# Altium project Performance_Fitness_Vest.PrjPcb (part 2 of 2)

## Sheet PTFV_GECKO_PWR.SchDoc: PTFV_GECKO_PWR_&_RF
size A4; DrawnBy: Aneesh & Vaishnavi; Revision: 1; SheetNumber: 3; SheetTotal: 3  of  5
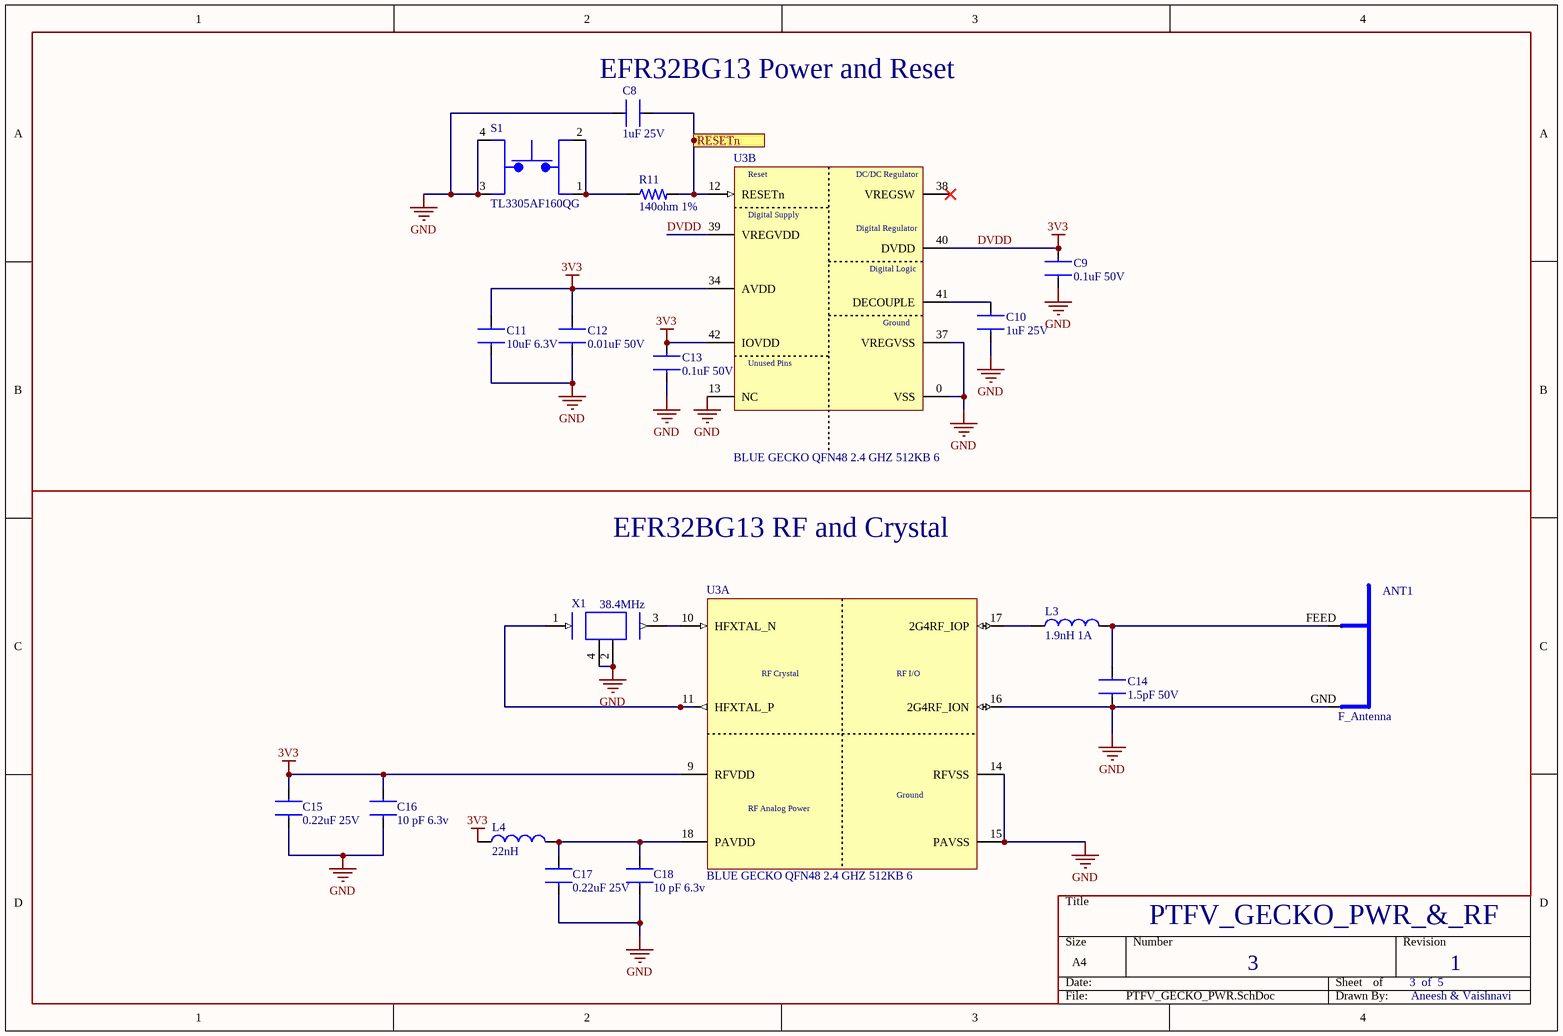
[diagram p2: PTFV_GECKO_PWR.SchDoc]

### Parts
ANT1  F_Antenna
C8  1uF 25V  [CAP_0603_1MM]
C9  0.1uF 50V  [CAP_0603_1MM]
C10  1uF 25V  [CAP_0603_1MM]
C11  10uF 6.3V  [CAP_0603_1MM]
C12  0.01uF 50V  [CAP_0603_1MM]
C13  0.1uF 50V  [CAP_0603_1MM]
C14  1.5pF 50V  [CAP_0402_1mm]
C15  0.22uF 25V  [CAP_0603_1MM]
C16  10 pF 6.3v  [CAP_0603_1MM]
C17  0.22uF 25V  [CAP_0603_1MM]
C18  10 pF 6.3v  [CAP_0603_1MM]
L3  1.9nH 1A  [CAP_0402_1mm]
L4  22nH  [IND_1608X10N]
R11  140ohm 1%  [RES_0603_1608X06]
S1  TL3305AF160QG  [SW_TL3305AF160QG]
U3  BLUE GECKO QFN48 2.4 GHZ 512KB 6  [QFN_48_7X7]  (parts A,B of 3)
X1  38.4MHz  [OSC_38.4MHz]

### Blocks framed on the sheet
EFR32BG13 Power and Reset: C8-C13 R11 S1 U3
EFR32BG13 RF and Crystal: ANT1 C14-C18 L3 L4 U3 X1

### Ports
RESETn (in, see PTFV_MECHANICAL[3A])

### Nets
3V3: C9.1 C11.1 C12.1 C13.1 C15.1 C16.1 L4.1 U3.9(RFVDD) U3.34(AVDD) U3.39(VREGVDD) U3.40(DVDD) U3.42(IOVDD)  [also labelled DVDD]
GND: ANT1.GND C8.2 C9.2 C10.2 C11.2 C12.2 C13.2 C14.2 C15.2 C16.2 C17.2 C18.2 S1.3 S1.4 U3.0(VSS) U3.13(NC) U3.14(RFVSS) U3.15(PAVSS) U3.16(2G4RF_ION) U3.37(VREGVSS) X1.2 X1.4
NetANT1_FEED: ANT1.FEED C14.1 L3.2
NetC8_1: C8.1 R11.2 U3.12(RESETn) ; port RESETn
NetC10_1: C10.1 U3.41(DECOUPLE)
NetC17_1: C17.1 C18.1 L4.2 U3.18(PAVDD)
NetL3_1: L3.1 U3.17(2G4RF_IOP)
NetR11_1: R11.1 S1.1 S1.2
NetU3_10: U3.10(HFXTAL_N) X1.3
NetU3_11: U3.11(HFXTAL_P) X1.1

Not connected (* = marked no-connect by the designer): U3 38(VREGSW)*

### Notes on the sheet
- (in symbol EFR32BG13P632F512GM48-DR, part A) RF Crystal; RF I/O; Ground; RF Analog Power
- (in symbol EFR32BG13P632F512GM48-DR, part B) Reset; DC/DC Regulator; Digital Supply; Digital Regulator; Digital Logic; Ground; Unused Pins

### Library data of the parts
ANT1 = F_Antenna: Inverted F Antenna
C8 C10 = CC0603KRX5R8BB105: CAP CER 1uF 25V X5R 0603; Manufacturer: Yageo; Dielectric Material: Ceramic; Multilayer: Yes; Tolerance  (fill in as +-): 10%; Supplier: Digi-Key; Supplier Part Number: 311-1445-1-ND; Manufacturer Part Number: CC0603KRX5R8BB105; RoHS: Yes; Category: Ceramic Capacitors; Stock: 2764440; Pricing: 1=0.1, 10=0.074, 50=0.0418, 100=0.0346, 500=0.02428, 1000=0.0201 (USD); Mounting Technology: Surface Mount; Pins: 2; Package Shape: Rectangular; Case/Package: 0603; Terminal Finish: Nickel; Min Operating Temperature: -55°C; Max Operating Temperature: 85°C; JESD-609 Code: e3; Value: 1uF; Capacitor Type: Ceramic; Package Style: SMTMeter; Packaging: Tape and Reel; Tolerance (fill in as +-): 10%; Rated DC Voltage (URdc): 25V; Temperature Characteristics Code: X5R; Termination: Wraparound; Length: 1.6mm; Width: 0.8mm; Height: 0.8mm; Reach SVHC Compliant: Yes; RoHS Compliant: Yes; ComponentLink1URL: https://datasheet.ciiva.com:443/pdfs/VipMasterIC/IC/YAGO/YAGO-S-A0006851646/YAGO-S-A0006851646-1.pdf?src-supplier=IHS+Markit; ComponentLink1Description: https://datasheet.ciiva.com:443/pdfs/VipMasterIC/IC/YAGO/YAGO-S-A0006851646/YAGO-S-A0006851646-1.pdf?src-supplier=IHS+Markit; ComponentLink2URL: https://datasheet.ciiva.com/7978/1525783-7978171.pdf?src-supplier=Element14; ComponentLink2Description: https://datasheet.ciiva.com/7978/1525783-7978171.pdf?src-supplier=Element14; ComponentLink3URL: https://datasheet.ciiva.com/11586/upy-gphc-x5r-4v-to-50v-12-11586318.pdf?src-supplier=Avnet; ComponentLink3Description: https://datasheet.ciiva.com/11586/upy-gphc-x5r-4v-to-50v-12-11586318.pdf?src-supplier=Avnet; ComponentLink4URL: https://datasheet.ciiva.com/176/mlccorderingcode-176786.pdf?src-supplier=Digi-Key; ComponentLink4Description: https://datasheet.ciiva.com/176/mlccorderingcode-176786.pdf?src-supplier=Digi-Key; ComponentLink5URL: https://datasheet.ciiva.com/176/mlccorderingcode-176785.pdf?src-supplier=Digi-Key; ComponentLink5Description: https://datasheet.ciiva.com/176/mlccorderingcode-176785.pdf?src-supplier=Digi-Key; ComponentLink6URL: https://datasheet.ciiva.com/176/mlccorderingcode-176787.pdf?src-supplier=Digi-Key; ComponentLink6Description: https://datasheet.ciiva.com/176/mlccorderingcode-176787.pdf?src-supplier=Digi-Key
C9 C13 = CC0603KRX5R9BB104: CAP CER 0.1UF 50V X5R 0603; Manufacturer: Yageo; Value: 100nF; Tolerance: 10%; Supplier: Digi-Key; Supplier Part Number: 311-4046-1-ND; Manufacturer Part Number: CC0603KRX5R9BB104; RoHS: Yes; Category: Ceramic Capacitors; Stock: 45165; Pricing: 1=0.1, 10=0.052, 50=0.0282, 100=0.0231, 500=0.01648, 1000=0.01294 (USD); Mounting Technology: Surface Mount; Case/Package: 0603; Case Code (Imperial): 0603; Case Code (Metric): 1608; Weight: 7.1E-05oz; Min Operating Temperature: -55°C; Max Operating Temperature: 85°C; Packaging: Tape and Reel; Voltage Rating: 50V; Dielectric: X5R; Termination: SMD/SMT; Voltage Rating (DC): 50V; Package Quantity: 4000; Series: CC; Length: 0.063inch; Width: 0.031inch; Thickness: 0.035inch; Lead Free: Lead Free; Halogen Free: Halogen Free; ComponentLink1URL: http://www.mouser.com/ds/2/447/Yageo_UPY-GP_NP0_16V-to-50V_9-358835.pdf?src-supplier=Mouser; ComponentLink1Description: http://www.mouser.com/ds/2/447/Yageo_UPY-GP_NP0_16V-to-50V_9-358835.pdf?src-supplier=Mouser; ComponentLink2URL: http://www.yageo.com/exep/pages/download/literatures/ProductSelectionGuide%202014_Final_2.pdf?src-supplier=Digi-Key; ComponentLink2Description: http://www.yageo.com/exep/pages/download/literatures/ProductSelectionGuide%202014_Final_2.pdf?src-supplier=Digi-Key; ComponentLink3URL: https://datasheet.octopart.com/CC0603KRX5R9BB104-Yageo-datasheet-158238148.pdf?src-supplier=Newark; ComponentLink3Description: https://datasheet.octopart.com/CC0603KRX5R9BB104-Yageo-datasheet-158238148.pdf?src-supplier=Newark; ComponentLink4URL: https://www.yageo.com/upload/media/product/productsearch/datasheet/mlcc/UPY-GPHC_X5R_4V-to-50V_26.pdf?src-supplier=Digi-Key; ComponentLink4Description: https://www.yageo.com/upload/media/product/productsearch/datasheet/mlcc/UPY-GPHC_X5R_4V-to-50V_26.pdf?src-supplier=Digi-Key; ComponentLink5URL: https://datasheet.octopart.com/CC0603KRX5R9BB104-Yageo-datasheet-137875056.pdf?src-supplier=Future+Electronics; ComponentLink5Description: https://datasheet.octopart.com/CC0603KRX5R9BB104-Yageo-datasheet-137875056.pdf?src-supplier=Future+Electronics
C11 = CL10A106MQ8NNNC: CAP CER 10UF 6.3V X5R 0603; Manufacturer: Samsung; Tolerance: 20%; Supplier: Digi-Key; Supplier Part Number: 1276-1119-1-ND; Manufacturer Part Number: CL10A106MQ8NNNC; RoHS: Yes; Category: Ceramic Capacitors; Stock: 2041935; Pricing: 1=0.11, 10=0.083, 50=0.0452, 100=0.0369, 500=0.02638, 1000=0.02072 (USD); Mounting Technology: Surface Mount; Case/Package: 0603; Case Code (Metric): 1608; Case Code (Imperial): 0603; Min Operating Temperature: -55°C; Max Operating Temperature: 85°C; Packaging: Tape and Reel; Value: 10uF; Voltage Rating: 6.3V; Dielectric: X5R; Voltage: 6.3V; Series: CL; Construction: Flat; Length: 1.6mm; Height: 0.8mm; Depth: 0.8mm; Radiation Hardening: No; RoHS Compliant: Yes; ComponentLink1URL: https://datasheet.ciiva.com/25798/cl10a106mq8nnnc-25798320.pdf?src-supplier=Digi-Key; ComponentLink1Description: https://datasheet.ciiva.com/25798/cl10a106mq8nnnc-25798320.pdf?src-supplier=Digi-Key; ComponentLink2URL: https://datasheet.ciiva.com/26838/getdatasheetpartid-357557-26838347.pdf?src-supplier=Verical; ComponentLink2Description: https://datasheet.ciiva.com/26838/getdatasheetpartid-357557-26838347.pdf?src-supplier=Verical; ComponentLink3URL: https://datasheet.ciiva.com/16437/cl05b104kq5nnnc-16437327.pdf?src-supplier=Future+Electronics; ComponentLink3Description: https://datasheet.ciiva.com/16437/cl05b104kq5nnnc-16437327.pdf?src-supplier=Future+Electronics
C12 = CC0603KRX7R9BB103: CAP CER 0.01uF 50V X7R 0603; Manufacturer: Yageo; Dielectric Material: Ceramic; Value: 10nF; Multilayer: Yes; Tolerance  (fill in as +-): 10%; Supplier: Digi-Key; Supplier Part Number: 311-1085-1-ND; Manufacturer Part Number: CC0603KRX7R9BB103; RoHS: Yes; Category: Ceramic Capacitors; Stock: 5912727; Pricing: 1=0.1, 10=0.032, 50=0.0176, 100=0.0144, 500=0.01026, 1000=0.00805 (USD); Mounting Technology: Surface Mount; Pins: 2; Package Shape: Rectangular; Case/Package: 0603; Terminal Finish: Nickel; Min Operating Temperature: -55°C; Max Operating Temperature: 125°C; JESD-609 Code: e3; Capacitor Type: Ceramic; Package Style: SMTMeter; Packaging: Tape and Reel; Tolerance (fill in as +-): 10%; Rated DC Voltage (URdc): 50V; Temperature Characteristics Code: X7R; Termination: Wraparound; Length: 1.6mm; Width: 0.8mm; Height: 0.8mm; Reach SVHC Compliant: Yes; RoHS Compliant: Yes; ComponentLink1URL: https://datasheet.ciiva.com:443/pdfs/VipMasterIC/IC/YAGO/YAGO-S-A0003557223/YAGO-S-A0003557223-1.pdf?src-supplier=IHS+Markit; ComponentLink1Description: https://datasheet.ciiva.com:443/pdfs/VipMasterIC/IC/YAGO/YAGO-S-A0003557223/YAGO-S-A0003557223-1.pdf?src-supplier=IHS+Markit; ComponentLink2URL: https://datasheet.ciiva.com/28450/1489800-28450619.pdf?src-supplier=Element14; ComponentLink2Description: https://datasheet.ciiva.com/28450/1489800-28450619.pdf?src-supplier=Element14; ComponentLink3URL: https://datasheet.ciiva.com/176/mlccorderingcode-176551.pdf?src-supplier=Digi-Key; ComponentLink3Description: https://datasheet.ciiva.com/176/mlccorderingcode-176551.pdf?src-supplier=Digi-Key; ComponentLink4URL: https://datasheet.ciiva.com/176/mlccorderingcode-176550.pdf?src-supplier=Digi-Key; ComponentLink4Description: https://datasheet.ciiva.com/176/mlccorderingcode-176550.pdf?src-supplier=Digi-Key; ComponentLink5URL: https://datasheet.ciiva.com/13389/upy-gphc-x7r-6-3v-to-50v-8-13389991.pdf?src-supplier=Mouser; ComponentLink5Description: https://datasheet.ciiva.com/13389/upy-gphc-x7r-6-3v-to-50v-8-13389991.pdf?src-supplier=Mouser
C14 = GCM1555C1H1R5JA16D: CAP CER 1.5pF 50V C0G 5% Pad SMD 0402 125C Automotive T/R; Manufacturer: Murata; Supplier 1: Digi-Key; Manufacturer Part Number: GCM1555C1H1R5JA16D; RoHS: Yes; Category: Ceramic Capacitors; Stock 1: 77943; Pricing 1: 1=0.10000, 10=0.04700, 50=0.02580, 100=0.02100, 500=0.01502, 1000=0.01180, 2500=0.01072, 5000=0.00987 (USD); Mount: Surface Mount; Case/Package: 0402; Case Code (Imperial): 0402; Case Code (Metric): 1005; Min Operating Temperature: -55°C; Max Operating Temperature: 125°C; Packaging: Cut Tape; Capacitance: 1.5pF; Tolerance: 5%; Voltage Rating: 50V; Ratings: AEC-Q200; ComponentLink1URL: http://search.murata.co.jp/Ceramy/image/img/A01X/G101/ENG/GCM1555C1H1R5JA16-01.pdf?src-supplier=Digi-Key; ComponentLink1Description: http://search.murata.co.jp/Ceramy/image/img/A01X/G101/ENG/GCM1555C1H1R5JA16-01.pdf?src-supplier=Digi-Key
C15 C17 = VJ0603Y224KXXCW1BC: CAP CER 0.22UF 25V X7R 0603; Manufacturer: Vishay Vitramon; Dielectric Material: Tantalum; Value: 220nF; Tolerance: 10%; Supplier: Digi-Key; Supplier Part Number: 720-VJ0603Y224KXXCW1BCCT-ND; Manufacturer Part Number: VJ0603Y224KXXCW1BC; RoHS: Yes; Category: Ceramic Capacitors; Stock: 7772; Pricing: 1=0.17, 10=0.116, 50=0.0696, 100=0.0587, 500=0.04018, 1000=0.03554 (USD); Mounting Technology: Surface Mount; Case/Package: 0603; Min Operating Temperature: -55°C; Max Operating Temperature: 125°C; Dielectric: X7R; Voltage Rating (DC): 25V; Construction: Flat; Length: 1.6mm; Depth: 0.8mm; Lead Free: Lead Free; RoHS Compliant: Yes; ComponentLink1URL: https://www.vishay.com/docs/28548/vjw1bcbascomseries.pdf?src-supplier=Digi-Key; ComponentLink1Description: https://www.vishay.com/docs/28548/vjw1bcbascomseries.pdf?src-supplier=Digi-Key; ComponentLink2URL: http://www.vishay.com/docs/28548/vjw1bcbascomseries.pdf?src-supplier=Avnet; ComponentLink2Description: http://www.vishay.com/docs/28548/vjw1bcbascomseries.pdf?src-supplier=Avnet; ComponentLink3URL: https://datasheet.octopart.com/VJ0603Y224KXXCW1BC-Vishay-datasheet-79783898.pdf?src-supplier=Future+Electronics; ComponentLink3Description: https://datasheet.octopart.com/VJ0603Y224KXXCW1BC-Vishay-datasheet-79783898.pdf?src-supplier=Future+Electronics
C16 C18 = 06036A100FAT2A: CAP CER 10pF 6.3V 0603; Manufacturer: Kyocera AVX; Tolerance: 1%; Dielectric: C0G; Supplier: Digi-Key; Supplier Part Number: 478-06036A100FAT2ACT-ND; Manufacturer Part Number: 06036A100FAT2A; RoHS: Yes; Category: Ceramic Capacitors; Stock: 26845; Pricing: 1=0.16, 10=0.112, 50=0.0636, 100=0.0526, 500=0.0369, 1000=0.03054 (USD); Mounting Technology: Surface Mount; Case/Package: 0603; Min Operating Temperature: -55°C; Max Operating Temperature: 125°C; Value: 10pF; Package Quantity: 4000; Packaging: Tape and Reel; Voltage Rating (DC): 6.3V; Construction: Flat; Length: 1.6mm; Depth: 0.81mm; RoHS Compliant: Yes; ComponentLink1URL: http://www.mouser.com/ds/2/40/C0GNP0-Dielectric-951274.pdf?src-supplier=Mouser; ComponentLink1Description: http://www.mouser.com/ds/2/40/C0GNP0-Dielectric-951274.pdf?src-supplier=Mouser
L3 = LQG15WZ1N9S02D: Inductor Chip 1.9nH 0.3nH Tolerance 2-Pin 0402 Paper T/R; Manufacturer: Murata; Supplier 1: Digi-Key; Manufacturer Part Number: LQG15WZ1N9S02D; RoHS: Yes; Category: Fixed Inductors; Stock 1: 7252; Pricing 1: 1=0.14000, 10=0.12900, 25=0.11440, 50=0.09720, 100=0.08580, 250=0.07864, 500=0.07150, 1000=0.06006, 2500=0.05148 (USD); RoHS Compliant: Yes
L4 = 7447860122: IND CER  22nH, 1.6Ghz, 0.3A, 0603 Rohs Compliant: Yes; Manufacturer: Wurth Electronics; Supplier: Digi-Key; Supplier Part Number: 732-7447860122CT-ND; Manufacturer Part Number: 7447860122; RoHS: No; Stock: 16578; Pricing: 1=0.1, 10=0.058, 50=0.054, 100=0.05, 1000=0.046 (USD); RoHS Compliant: Yes
R11 = RC0603FR-07140RL: RES SMD 140 OHM 1% 1/10W 0603; Manufacturer: Yageo; Additional Feature: LASER TRIMMABLE; Power: 100mW; Rated Temperature: 70°C; Value: 140R; Temperature Coefficient: 100ppm/°C; Working Voltage: 75V; Package Height: 0.45mm; Package Length: 1.6mm; Package Width: 0.8mm; Supplier: Digi-Key; Supplier Part Number: 311-140HRCT-ND; Manufacturer Part Number: RC0603FR-07140RL; RoHS: Yes; Category: Chip SMD Resistors; Stock: 420006; Pricing: 1=0.1, 10=0.018, 50=0.0106, 100=0.0088, 500=0.00592, 1000=0.00505 (USD); Mounting Technology: Surface Mount; Pins: 2; Package Shape: Rectangular; Case/Package: 0603; Terminal Finish: Nickel; Min Operating Temperature: -55°C; Max Operating Temperature: 155°C; Tolerance: 1%; JESD-609 Code: e3; Resistor Type: FIXED RESISTOR; Construction: Chip; Package Style: SMTMeter; Packaging: Tape and Reel; Technology: METAL GLAZE/THICK FILM; Termination: Wraparound; Reach SVHC Compliant: Yes; RoHS Compliant: Yes; ComponentLink1URL: https://datasheet.ciiva.com:443/pdfs/VipMasterIC/IC/YAGO/YAGO-S-A0008145938/YAGO-S-A0008145938-1.pdf?src-supplier=IHS+Markit; ComponentLink1Description: https://datasheet.ciiva.com:443/pdfs/VipMasterIC/IC/YAGO/YAGO-S-A0008145938/YAGO-S-A0008145938-1.pdf?src-supplier=IHS+Markit; ComponentLink2URL: https://datasheet.ciiva.com/11808/0900766b80c66297-11808828.pdf?src-supplier=Rs; ComponentLink2Description: https://datasheet.ciiva.com/11808/0900766b80c66297-11808828.pdf?src-supplier=Rs; ComponentLink3URL: https://datasheet.ciiva.com/15189/getdatasheetpartid-329205-15189606.pdf?src-supplier=Verical; ComponentLink3Description: https://datasheet.ciiva.com/15189/getdatasheetpartid-329205-15189606.pdf?src-supplier=Verical
S1 = TL3305AF160QG: Tactile Switch SPST-NO Top Actuated Surface Mount; MF: E-Switch; Package: None; Check_prices: https://www.snapeda.com/parts/TL3305AF160QG/E-Switch/view-part/?ref=eda; Value: *; Purchase-URL: https://pricing.snapeda.com/search/part/TL3305AF160QG/?ref=eda; Availability: In Stock; SnapEDA_Link: https://www.snapeda.com/parts/TL3305AF160QG/E-Switch/view-part/?ref=snap; MP: TL3305AF160QG; Price: None
U3 = EFR32BG13P632F512GM48-DR: Blue Gecko BLE Soc QFN48 2.4 G 10 dB BLE/Proprietary 512 kB 64 kB(RAM) 31GPIO; Manufacturer: Silicon Labs; Interface: I2C,SPI,IrDA,UART,USART; Frequency: 2.4835GHz; Data Rate: 2Mbps; Sensitivity: -103.3dBm; Memory Size: 64KB; Current - Receiving: 14mA; Current - Transmitting: 134.3mA; Number of GPIO: 16; Supplier: Digi-Key; Supplier Part Number: 336-EFR32BG13P632F512GM48-DRCT-ND; Manufacturer Part Number: EFR32BG13P632F512GM48-DR; RoHS: Yes; Category: RF Receivers, Transceivers; Stock: 17415; Pricing: 1=7.18, 10=6.577, 25=5.9792, 100=5.3813, 250=4.93284, 500=4.4844, 1000=4.03596 (USD); Mounting Technology: Surface Mount; Case/Package: QFN; Min Operating Temperature: -40°C; Max Operating Temperature: 85°C; Series: EFR32™ Blue Gecko; RoHS Compliant: Yes
X1 = RH100-38.400-10-F-1010-TR: Crystal 38.4000MHZ 10PF SMD; Manufacturer: Raltron Electronics; Supplier 1: Digi-Key; Manufacturer Part Number: RH100-38.400-10-F-1010-TR; RoHS: Yes; Stock 1: 6000; Pricing 1: 1=0.39000, 10=0.32400, 50=0.29180, 100=0.25940, 500=0.24640, 1000=0.20750 (USD)

## Sheet PTFV_GECKO_SNSR.SchDoc: PTFV_GECKO_SNSR
size A4; DrawnBy: Devang Boradhara; Revision: 1; SheetNumber: 5; SheetTotal: 5  of  5
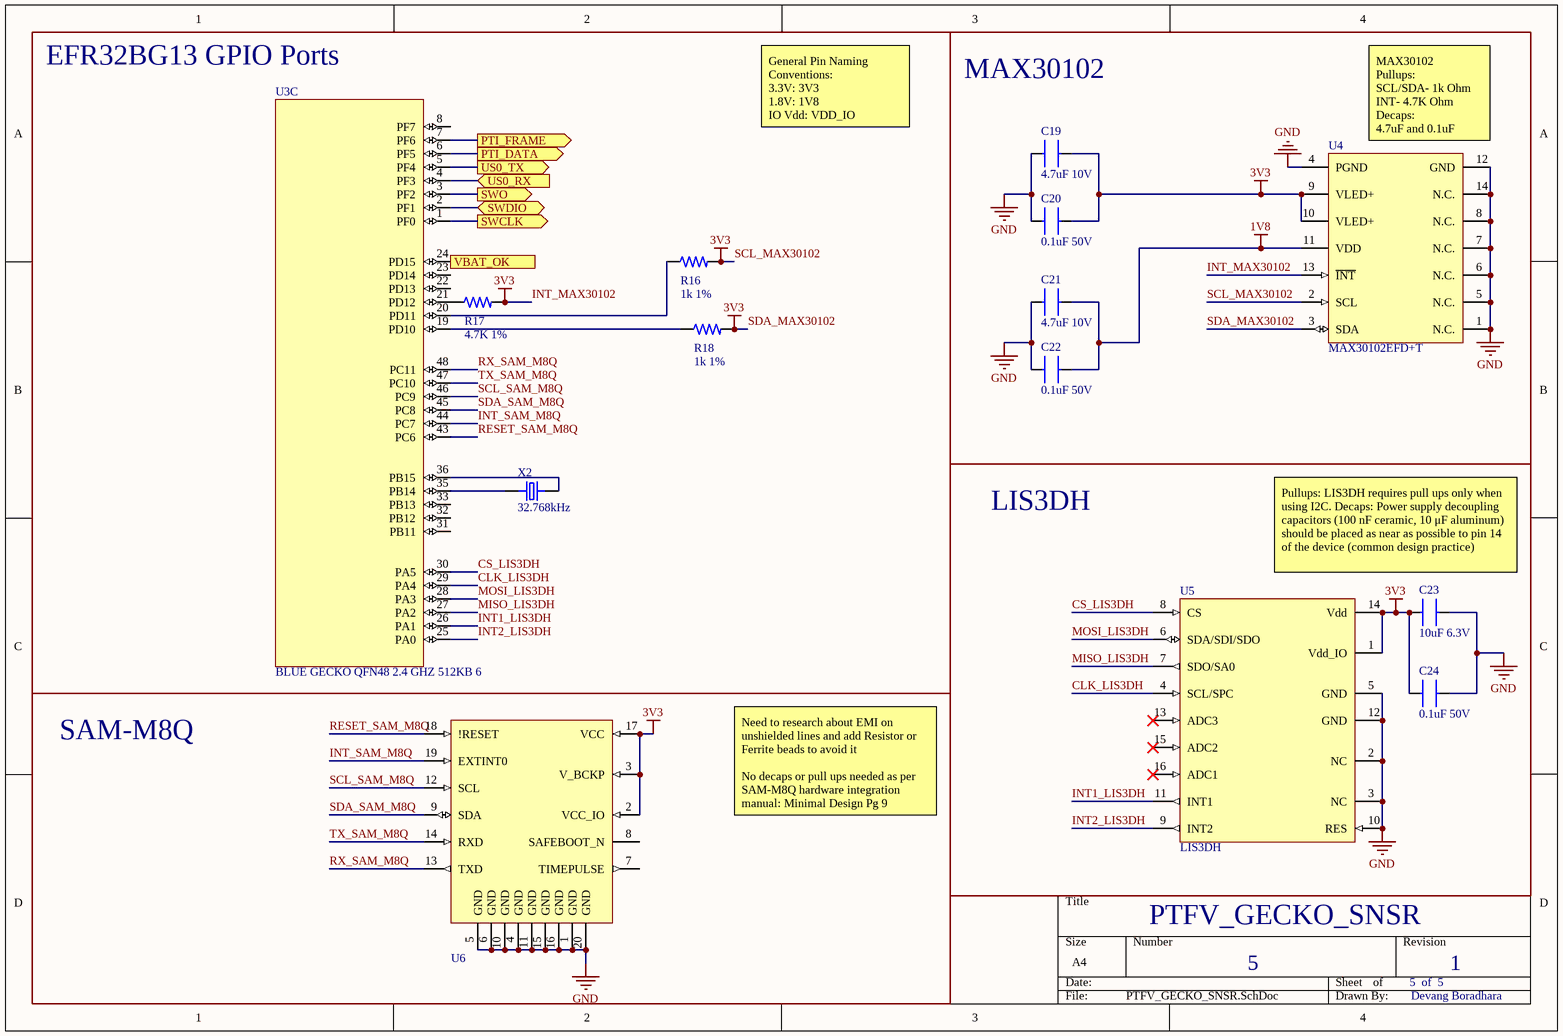
[diagram p3: PTFV_GECKO_SNSR.SchDoc]

### Parts
C19  4.7uF 10V  [CAP_0603_1MM]
C20  0.1uF 50V  [CAP_0603_1MM]
C21  4.7uF 10V  [CAP_0603_1MM]
C22  0.1uF 50V  [CAP_0603_1MM]
C23  10uF 6.3V  [CAP_0603_1MM]
C24  0.1uF 50V  [CAP_0603_1MM]
R16  1k 1%  [RES_0603_1608X06]
R17  4.7K 1%  [RES_0603_1608X06]
R18  1k 1%  [RES_0603_1608X06]
U3  BLUE GECKO QFN48 2.4 GHZ 512KB 6  [QFN_48_7X7]  (part C of 3)
U4  MAX30102EFD+T  [14_SON_SPO2]
U5  LIS3DH  [16_QFN_LIS3DH]
U6  GPS_SAM-M8Q  [20_QFN_SAM_M8Q]  (value not drawn)
X2  32.768kHz  [XTAL_ECS-.327-7-34B-TR]

### Blocks framed on the sheet
EFR32BG13 GPIO Ports: R16-R18 U3 X2
MAX30102: C19-C22 U4
LIS3DH: C23 C24 U5
SAM-M8Q: U6

### Ports
PTI_DATA (out, see PTFV_MECHANICAL[4A]), PTI_FRAME (out, see PTFV_MECHANICAL[3A]), SWCLK (out, see PTFV_MECHANICAL[4A]), SWDIO (bidir, see PTFV_MECHANICAL[3A]), SWO (out, see PTFV_MECHANICAL[4A]), US0_RX (in, see PTFV_MECHANICAL[4A]), US0_TX (out, see PTFV_MECHANICAL[3A]), VBAT_OK (in, see PTFV_PWR_PMIC[2C])

### Nets
1V8: C21.1 C22.1 U4.11(VDD)
3V3: C19.1 C20.1 C23.2 C24.2 R16.2 R17.2 R18.2 U4.2(SCL) U4.3(SDA) U4.9(VLED+) U4.10(VLED+) U4.13(~{INT}) U5.1(Vdd_IO) U5.14(Vdd) U6.2(VCC_IO) U6.3(V_BCKP) U6.17(VCC)  [also labelled INT_MAX30102, SCL_MAX30102, SDA_MAX30102]
GND: C19.2 C20.2 C21.2 C22.2 C23.1 C24.1 U4.1(N.C.) U4.4(PGND) U4.5(N.C.) U4.6(N.C.) U4.7(N.C.) U4.8(N.C.) U4.12(GND) U4.14(N.C.) U5.2(NC) U5.3(NC) U5.5(GND) U5.10(RES) U5.12(GND) U6.1(GND) U6.4(GND) U6.5(GND) U6.6(GND) U6.10(GND) U6.11(GND) U6.15(GND) U6.16(GND) U6.20(GND)
CLK_LIS3DH: U3.29(PA4) U5.4(SCL/SPC)
CS_LIS3DH: U3.30(PA5) U5.8(CS)
INT1_LIS3DH: U3.26(PA1) U5.11(INT1)
INT2_LIS3DH: U3.25(PA0) U5.9(INT2)
INT_SAM_M8Q: U3.44(PC7) U6.19(EXTINT0)
MISO_LIS3DH: U3.27(PA2) U5.7(SDO/SA0)
MOSI_LIS3DH: U3.28(PA3) U5.6(SDA/SDI/SDO)
RESET_SAM_M8Q: U3.43(PC6) U6.18(!RESET)
RX_SAM_M8Q: U3.48(PC11) U6.13(TXD)
SCL_SAM_M8Q: U3.46(PC9) U6.12(SCL)
SDA_SAM_M8Q: U3.45(PC8) U6.9(SDA)
TX_SAM_M8Q: U3.47(PC10) U6.14(RXD)
NetH1_4: U3.4(PF3) ; port US0_RX
NetH1_5: U3.5(PF4) ; port US0_TX
NetH1_6: U3.3(PF2) ; port SWO
NetH1_7: U3.2(PF1) ; port SWDIO
NetH1_8: U3.1(PF0) ; port SWCLK
NetH1_9: U3.7(PF6) ; port PTI_FRAME
NetH1_10: U3.6(PF5) ; port PTI_DATA
NetR16_1: R16.1 U3.20(PD11)
NetR17_1: R17.1 U3.21(PD12)
NetR18_1: R18.1 U3.19(PD10)
NetU1_13: U3.24(PD15) ; port VBAT_OK
NetU3_35: U3.35(PB14) X2.1
NetU3_36: U3.36(PB15) X2.2

Not connected (* = marked no-connect by the designer): U3 8(PF7) 22(PD13) 23(PD14) 31(PB11) 32(PB12) 33(PB13); U5 13(ADC3)* 15(ADC2)* 16(ADC1)*; U6 7(TIMEPULSE) 8(SAFEBOOT_N)

### Notes on the sheet
- General Pin Naming Conventions:
  3.3V: 3V3
  1.8V: 1V8
  IO Vdd: VDD_IO
- (near U4) MAX30102
  Pullups:
  SCL/SDA- 1k Ohm
  INT- 4.7K Ohm
  Decaps:
  4.7uF and 0.1uF
- Pullups: LIS3DH requires pull ups only when using I2C. Decaps: Power supply decoupling capacitors (100 nF ceramic, 10 μF aluminum) should be placed as near as possible to pin 14 of the device (common design practice)
- Need to research about EMI on unshielded lines and add Resistor or Ferrite beads to avoid it
  No decaps or pull ups needed as per  SAM-M8Q hardware integration manual: Minimal Design Pg 9

### Library data of the parts
C19 C21 = CL10A475KP8NNNC: CAP CER 4.7UF 10V X5R 0603; Manufacturer: Samsung; Material: 4241ConductorMaterial; Tolerance: 10%; Supplier: Digi-Key; Supplier Part Number: 1276-1044-1-ND; Manufacturer Part Number: CL10A475KP8NNNC; RoHS: Yes; Category: Ceramic Capacitors; Stock: 4678169; Pricing: 1=0.1, 10=0.043, 50=0.0234, 100=0.0192, 500=0.01368, 1000=0.01075 (USD); Mounting Technology: Surface Mount; Case/Package: 0603; Case Code (Metric): 1608; Case Code (Imperial): 0603; Min Operating Temperature: -55°C; Max Operating Temperature: 85°C; Package Quantity: 1; Packaging: Tape and Reel; Value: 4.7uF; Voltage Rating: 10V; Dielectric: X5R; Series: CL; Construction: Flat; Voltage Rating (DC): 10V; Length: 1.6mm; Width: 0.031inch; Height: 0.8mm; Thickness: 0.035inch; Depth: 0.8mm; Radiation Hardening: No; RoHS Compliant: Yes; ComponentLink1URL: https://datasheet.ciiva.com/25797/cl10a475kp8nnnc-25797520.pdf?src-supplier=Digi-Key; ComponentLink1Description: https://datasheet.ciiva.com/25797/cl10a475kp8nnnc-25797520.pdf?src-supplier=Digi-Key; ComponentLink2URL: https://datasheet.ciiva.com/26838/getdatasheetpartid-358676-26838384.pdf?src-supplier=Verical; ComponentLink2Description: https://datasheet.ciiva.com/26838/getdatasheetpartid-358676-26838384.pdf?src-supplier=Verical; ComponentLink3URL: https://datasheet.ciiva.com/16318/cl05b104kq5nnnc-16318245.pdf?src-supplier=Future+Electronics; ComponentLink3Description: https://datasheet.ciiva.com/16318/cl05b104kq5nnnc-16318245.pdf?src-supplier=Future+Electronics
C20 C22 C24 = CC0603KRX5R9BB104: as C9 on sheet PTFV_GECKO_PWR; Supplier: Digi-Key; Supplier Part Number: 311-4046-1-ND; Manufacturer Part Number: CC0603KRX5R9BB104; RoHS: Yes; Category: Ceramic Capacitors; Stock: 45165; Pricing: 1=0.1, 10=0.052, 50=0.0282, 100=0.0231, 500=0.01648, 1000=0.01294 (USD); Mounting Technology: Surface Mount; Case/Package: 0603; Case Code (Imperial): 0603; Case Code (Metric): 1608; Weight: 7.1E-05oz; Min Operating Temperature: -55°C; Max Operating Temperature: 85°C; Packaging: Tape and Reel; Voltage Rating: 50V; Dielectric: X5R; Termination: SMD/SMT; Voltage Rating (DC): 50V; Package Quantity: 4000; Series: CC; Length: 0.063inch; Width: 0.031inch; Thickness: 0.035inch; Lead Free: Lead Free; Halogen Free: Halogen Free; ComponentLink1URL: http://www.mouser.com/ds/2/447/Yageo_UPY-GP_NP0_16V-to-50V_9-358835.pdf?src-supplier=Mouser; ComponentLink1Description: http://www.mouser.com/ds/2/447/Yageo_UPY-GP_NP0_16V-to-50V_9-358835.pdf?src-supplier=Mouser; ComponentLink2URL: http://www.yageo.com/exep/pages/download/literatures/ProductSelectionGuide%202014_Final_2.pdf?src-supplier=Digi-Key; ComponentLink2Description: http://www.yageo.com/exep/pages/download/literatures/ProductSelectionGuide%202014_Final_2.pdf?src-supplier=Digi-Key; ComponentLink3URL: https://datasheet.octopart.com/CC0603KRX5R9BB104-Yageo-datasheet-158238148.pdf?src-supplier=Newark; ComponentLink3Description: https://datasheet.octopart.com/CC0603KRX5R9BB104-Yageo-datasheet-158238148.pdf?src-supplier=Newark; ComponentLink4URL: https://www.yageo.com/upload/media/product/productsearch/datasheet/mlcc/UPY-GPHC_X5R_4V-to-50V_26.pdf?src-supplier=Digi-Key; ComponentLink4Description: https://www.yageo.com/upload/media/product/productsearch/datasheet/mlcc/UPY-GPHC_X5R_4V-to-50V_26.pdf?src-supplier=Digi-Key; ComponentLink5URL: https://datasheet.octopart.com/CC0603KRX5R9BB104-Yageo-datasheet-137875056.pdf?src-supplier=Future+Electronics; ComponentLink5Description: https://datasheet.octopart.com/CC0603KRX5R9BB104-Yageo-datasheet-137875056.pdf?src-supplier=Future+Electronics
C23 = CL10A106MQ8NNNC: as C11 on sheet PTFV_GECKO_PWR; Supplier: Digi-Key; Supplier Part Number: 1276-1119-1-ND; Manufacturer Part Number: CL10A106MQ8NNNC; RoHS: Yes; Category: Ceramic Capacitors; Stock: 2041935; Pricing: 1=0.11, 10=0.083, 50=0.0452, 100=0.0369, 500=0.02638, 1000=0.02072 (USD); Mounting Technology: Surface Mount; Case/Package: 0603; Case Code (Metric): 1608; Case Code (Imperial): 0603; Min Operating Temperature: -55°C; Max Operating Temperature: 85°C; Packaging: Tape and Reel; Value: 10uF; Voltage Rating: 6.3V; Dielectric: X5R; Voltage: 6.3V; Series: CL; Construction: Flat; Length: 1.6mm; Height: 0.8mm; Depth: 0.8mm; Radiation Hardening: No; RoHS Compliant: Yes; ComponentLink1URL: https://datasheet.ciiva.com/25798/cl10a106mq8nnnc-25798320.pdf?src-supplier=Digi-Key; ComponentLink1Description: https://datasheet.ciiva.com/25798/cl10a106mq8nnnc-25798320.pdf?src-supplier=Digi-Key; ComponentLink2URL: https://datasheet.ciiva.com/26838/getdatasheetpartid-357557-26838347.pdf?src-supplier=Verical; ComponentLink2Description: https://datasheet.ciiva.com/26838/getdatasheetpartid-357557-26838347.pdf?src-supplier=Verical; ComponentLink3URL: https://datasheet.ciiva.com/16437/cl05b104kq5nnnc-16437327.pdf?src-supplier=Future+Electronics; ComponentLink3Description: https://datasheet.ciiva.com/16437/cl05b104kq5nnnc-16437327.pdf?src-supplier=Future+Electronics
R16 R18 = RC0603FR-071KL: RES SMD 1k OHM 1% 1/10W 0603; Manufacturer: Yageo; Power Rating: 100mW; Value: 1kR; Voltage Rating: 50V; Temperature Coefficient: 100ppm/°C; Supplier: Digi-Key; Supplier Part Number: 311-1.00KHRCT-ND; Manufacturer Part Number: RC0603FR-071KL; RoHS: Yes; Category: Chip SMD Resistors; Stock: 18911788; Pricing: 1=0.1, 10=0.018, 50=0.0106, 100=0.0088, 500=0.00592, 1000=0.00505 (USD); Case/Package: 0603; Case Code (Imperial): 0603; Case Code (Metric): 1608; Contact Plating: Tin,Matte; Min Operating Temperature: -55°C; Max Operating Temperature: 155°C; Tolerance: 1%; Packaging: Tape and Reel; Termination: SMD/SMT; Resistor Type: Thick Film; Features: Moisture Resistant; Series: RC; Max Power Dissipation: 100mW; Number of Terminations: 2; Resistance Tolerance: 1%; Construction: Rectangular; Technology: THICK FILM; Length: 1.6mm; Height: 0.45mm; Depth: 0.8mm; Reach SVHC Compliant: No; Military Standard: Not; RoHS Compliant: Yes; Lead Free: 5697LeadFree
R17 = RMCF0603FT4K70: RES SMD 4.7K OHM 1% 1/10W 0603; Manufacturer: Stackpole Electronics; Value: 4.7kR; Max Power Dissipation: 100mW; Temperature Coefficient: 100ppm/°C; Supplier: Digi-Key; Supplier Part Number: RMCF0603FT4K70CT-ND; Manufacturer Part Number: RMCF0603FT4K70; RoHS: Yes; Category: Chip SMD Resistors; Stock: 560754; Pricing: 1=0.1, 10=0.014, 50=0.0086, 100=0.0071, 500=0.00474, 1000=0.00404 (USD); Mounting Technology: Surface Mount; Case/Package: 0603; Case Code (Metric): 1608; Case Code (Imperial): 0603; Contact Plating: Tin,Matte; Min Operating Temperature: -55°C; Max Operating Temperature: 155°C; Packaging: Tape and Reel; Tolerance: 1%; Number of Terminations: 2; Features: Automotive AEC-Q200; Series: RMCF; Construction: Rectangular; Length: 0.061inch; Width: 0.031inch; Height: 0.022inch; Depth: 0.8mm; Radiation Hardening: No; Military Standard: Not; Lead Free: Lead Free; RoHS Compliant: Yes; ComponentLink1URL: https://datasheet.ciiva.com/26835/getdatasheetpartid-486078-26835642.pdf?src-supplier=Verical; ComponentLink1Description: https://datasheet.ciiva.com/26835/getdatasheetpartid-486078-26835642.pdf?src-supplier=Verical
U3 = EFR32BG13P632F512GM48-DR: as U3 on sheet PTFV_GECKO_PWR; Supplier: Digi-Key; Supplier Part Number: 336-EFR32BG13P632F512GM48-DRCT-ND; Manufacturer Part Number: EFR32BG13P632F512GM48-DR; RoHS: Yes; Category: RF Receivers, Transceivers; Stock: 17415; Pricing: 1=7.18, 10=6.577, 25=5.9792, 100=5.3813, 250=4.93284, 500=4.4844, 1000=4.03596 (USD); Mounting Technology: Surface Mount; Case/Package: QFN; Min Operating Temperature: -40°C; Max Operating Temperature: 85°C; Series: EFR32™ Blue Gecko; RoHS Compliant: Yes
U4 = MAX30102EFD+T: SENSOR OXIMETER/HEART RATE I2C; Manufacturer: Maxim; Throw Configuration: ANALOG CIRCUIT; Channels: 1; Max Supply Voltage: 2V; Min Supply Voltage: 1.7V; Nominal Supply Voltage: 1.8V; Supplier: Digi-Key; Supplier Part Number: MAX30102EFD+TDKR-ND; Manufacturer Part Number: MAX30102EFD+T; RoHS: Yes; Category: Sensors; Stock: 778; Pricing: 1=10.88, 10=10, 25=9.5856, 100=8.4455, 250=8.031, 500=7.51288, 1000=6.89113 (USD); Pins: 14; Package Shape: Rectangular; Min Operating Temperature: -40°C; Max Operating Temperature: 85°C; Package Style: GRID ARRAY, LOW PROFILE, FINE PITCHMeter; Surface Mount: Yes; Terminal Form: BUTT; Terminal Position: BOTTOM; Length: 5.6mm; Width: 3.3mm; Height - Seated (Max): 1.65mm; Terminal Pitch: 0.8mm; Reach SVHC Compliant: Yes; Temperature Grade: INDUSTRIAL; RoHS Compliant: Yes; ComponentLink1URL: https://datasheet.ciiva.com:443/pdfs/VipMasterIC/IC/MAXM/MAXM-S-A0006604198/MAXM-S-A0006604198-1.pdf?src-supplier=IHS+Markit; ComponentLink1Description: https://datasheet.ciiva.com:443/pdfs/VipMasterIC/IC/MAXM/MAXM-S-A0006604198/MAXM-S-A0006604198-1.pdf?src-supplier=IHS+Markit; ComponentLink2URL: https://datasheets.maximintegrated.com/en/ds/MAX30102.pdf?src-supplier=Digi-Key; ComponentLink2Description: https://datasheets.maximintegrated.com/en/ds/MAX30102.pdf?src-supplier=Digi-Key
U5 = LIS3DH: MEMS digital output motion sensor: / ultra-low-power high-performance 3-axis "nano" accelerometer
U6 = SAM-M8Q-0-10: RF Receiver Galileo, GLONASS, GPS 1.575GHz, 1.602GHz -165dBm 400kbps On-Board, Patch Module; Manufacturer: u-blox; Telecom IC Type: TELECOM CIRCUIT; Supplier: Digi-Key; Supplier Part Number: 672-1054-1-ND; Manufacturer Part Number: SAM-M8Q-0; RoHS: Yes; Category: RF Receivers, Transceivers; Stock: 3732; Pricing: 1=31.5, 10=25.91, 50=21.24, 100=18.1279 (USD); RoHS Compliant: Yes; ComponentLink1URL: https://datasheet.ciiva.com:443/pdfs/VipMasterIC/IC/UBLO/UBLO-S-A0004996580/UBLO-S-A0004996580-1.pdf?src-supplier=IHS+Markit; ComponentLink1Description: https://datasheet.ciiva.com:443/pdfs/VipMasterIC/IC/UBLO/UBLO-S-A0004996580/UBLO-S-A0004996580-1.pdf?src-supplier=IHS+Markit; ComponentLink2URL: https://www.u-blox.com/sites/default/files/SAM-M8Q_DataSheet_%28UBX-16012619%29.pdf?src-supplier=Digi-Key; ComponentLink2Description: https://www.u-blox.com/sites/default/files/SAM-M8Q_DataSheet_%28UBX-16012619%29.pdf?src-supplier=Digi-Key
X2 = ECS-.327-7-34B-TR: 32.768kHz Â±20ppm Crystal 7pF 70 kOhms 2-SMD, No Lead; MF: ECS Inc.; Availability: Unavailable; MP: ECS-.327-7-34B-TR; Price: None; Value: *; SnapEDA_Link: https://www.snapeda.com/parts/ECS-.327-7-34B-TR/ECS%20Inc./view-part/55054/?ref=snap; Package: SMD-2 ECS International

## Sheet PTFV_MECHANICAL.SchDoc: PTFV_MECHANICAL
size A4; DrawnBy: All; Revision: 1; SheetNumber: 4; SheetTotal: 4  of  5
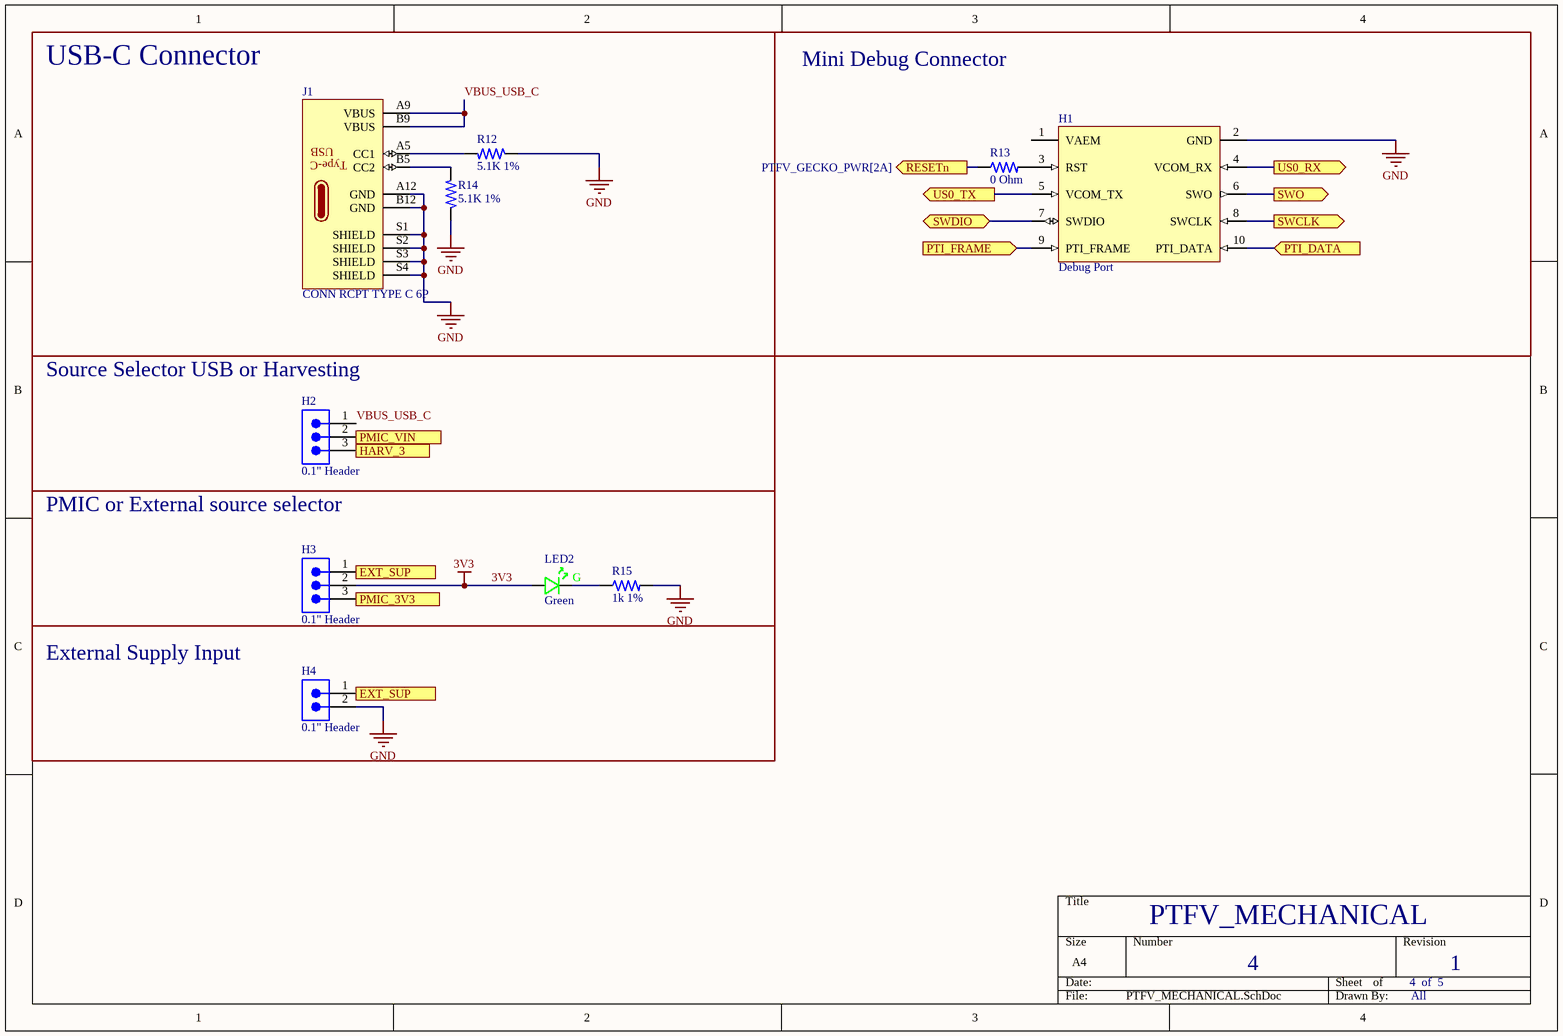
[diagram p4: PTFV_MECHANICAL.SchDoc]

### Parts
H1  Debug Port  [Amphenol_20021121_0]
H2  0.1" Header  [3-PIN_MALE_HEADER_01-IN]
H3  0.1" Header  [3-PIN_MALE_HEADER_01-IN]
H4  0.1" Header  [2-PIN_MALE_HEADER_01-IN]
J1  CONN RCPT TYPE C 6P  [USB4125-GF-A_REVA2]
LED2  Green  [LED_0603_GRN_WL-SMCW]
R12  5.1K 1%  [RES_0603_1608X06]
R13  0 Ohm  [RES_0603_1608X06]
R14  5.1K 1%  [RES_0603_1608X06]
R15  1k 1%  [RES_0603_1608X06]

### Blocks framed on the sheet
USB-C Connector: J1 R12 R14
Mini Debug Connector: H1 R13
Source Selector USB or Harvesting: H2
PMIC or External source selector: H3 LED2 R15
External Supply Input: H4

### Ports
EXT_SUP (in, see PTFV_MECHANICAL[1C]), EXT_SUP (out, see PTFV_MECHANICAL[1C]), HARV_3 (out, see PTFV_PWR_PMIC[1B]), PMIC_3V3 (in, see PTFV_PWR_PMIC[3B]), PMIC_VIN (out, see PTFV_PWR_PMIC[1B]), PTI_DATA (in, see PTFV_GECKO_SNSR[2A]), PTI_FRAME (in, see PTFV_GECKO_SNSR[2A]), RESETn (out, see PTFV_GECKO_PWR[2A]), SWCLK (out, see PTFV_GECKO_SNSR[2A]), SWDIO (bidir, see PTFV_GECKO_SNSR[2A]), SWO (out, see PTFV_GECKO_SNSR[2A]), US0_RX (out, see PTFV_GECKO_SNSR[2A]), US0_TX (out, see PTFV_GECKO_SNSR[2A])

### Nets
3V3: H3.2 LED2.A
GND: H1.2(GND) H4.2 J1.A12(GND) J1.B12(GND) J1.S1(SHIELD) J1.S2(SHIELD) J1.S3(SHIELD) J1.S4(SHIELD) R12.1 R14.1 R15.2
VBUS_USB_C: H2.1 J1.A9(VBUS) J1.B9(VBUS)
NetC3_1: H2.2 ; port PMIC_VIN
NetC6_1: H3.3 ; port PMIC_3V3
NetC8_1: R13.1 ; port RESETn
NetH1_3: H1.3(RST) R13.2
NetH1_4: H1.4(VCOM_RX) ; port US0_RX
NetH1_5: H1.5(VCOM_TX) ; port US0_TX
NetH1_6: H1.6(SWO) ; port SWO
NetH1_7: H1.7(SWDIO) ; port SWDIO
NetH1_8: H1.8(SWCLK) ; port SWCLK
NetH1_9: H1.9(PTI_FRAME) ; port PTI_FRAME
NetH1_10: H1.10(PTI_DATA) ; port PTI_DATA
NetH2_3: H2.3 ; port HARV_3
NetH3_1: H3.1 H4.1 ; port EXT_SUP
NetJ1_A5: J1.A5(CC1) R12.2
NetJ1_B5: J1.B5(CC2) R14.2
NetLED2_C: LED2.C R15.1

Not connected (* = marked no-connect by the designer): H1 1(VAEM)

### Notes on the sheet
- (in symbol 150060GS75000) G
- (in symbol USB_Type_C_6P_RA_TH) USB; Type-C

### Library data of the parts
H1 = 20021121-00010C1LF: CONN HEADER SMD 10POS 1.27MM. Connector Header Surface Mount 10 position 0.050"; Manufacturer: Amphenol ICC / FCI; Supplier 1: Digi-Key; Manufacturer Part Number: 20021121-00010C1LF; RoHS: No; Category: Headers and Wire Housings
H2 H3 = PRPC003SAAN-RC: CONN HEADER VERT 3POS 2.54MM; Manufacturer: Sullins; Connector Type: Header, Unshrouded, Breakaway; Number of Positions: 3; Number of Positions Loaded: All; Pitch: 0.100" (2.54mm); Online Catalog: 0.100" (2.54mm) Pitch Connector Headers; Other Names: S9510E-03  S9510E-03-ND; Supplier 1: Digi-Key; Manufacturer Part Number: PRPC003SAAN-RC; Stock 1: 19067; Pricing 1: 1=0.12, 10=0.109, 25=0.0812, 50=0.0696, 100=0.0673, 250=0.058, 500=0.0557 (USD); Standard Package: 1; Category: Connectors, Interconnects; Family: Rectangular Connectors - Headers, Male Pins; Series: -; Packaging: Bulk; Contact Type: Male Pin; Number of Rows: 1; Row Spacing: -; Contact Mating Length: 0.230" (5.84mm); Mounting Type: Through Hole; Termination: Solder; Fastening Type: -; Features: -; Contact Finish: Gold; Contact Finish Thickness: Flash; Color: Black; ComponentLink1URL: https://media.digikey.com/PDF/Data%20Sheets/Sullins%20PDFs/xRxCzzzSxxN-RC_ST_11635-B.pdf?src-supplier=Digi-Key; ComponentLink1Description: https://media.digikey.com/PDF/Data%20Sheets/Sullins%20PDFs/xRxCzzzSxxN-RC_ST_11635-B.pdf?src-supplier=Digi-Key; Supplier Part Number 1: S1011EC-03-ND
H4 = GRPB021VWVN-RC: Conn Unshrouded Header HDR 2 POS 2.54 MM Solder ST Top Entry Thru-Hole; Manufacturer: Sullins; Number of Positions: 2; Pitch: 1.27mm; Supplier: Digi-Key; Supplier Part Number: S9014E-02-ND; Manufacturer Part Number: GRPB021VWVN-RC; RoHS: Yes; Category: Headers and Wire Housings; Stock: 123797; Pricing: 1=0.25, 10=0.21, 100=0.1615, 500=0.13662, 1000=0.11178, 5000=0.09936, 10000=0.09005 (USD); Mounting Technology: Through Hole; Contact Material: Brass; Contact Shape: Square; Contact Finish - Mating: GOLD; Insulation Material: Nylon; Min Operating Temperature: -40°C; Max Operating Temperature: 105°C; Number of Rows: 1; Termination: Solder; Connector Type: Header; Contact Type: Male Pin; Fastening Type: Pull; Series: -; Packaging: Bulk; RoHS Compliant: Yes; Flammability Rating: UL94 V-0; Lead Free: Lead Free; ComponentLink1URL: https://datasheet.ciiva.com/726/71-grpb-1vwvn-rc-10957-c-726648.pdf?src-supplier=Digi-Key; ComponentLink1Description: https://datasheet.ciiva.com/726/71-grpb-1vwvn-rc-10957-c-726648.pdf?src-supplier=Digi-Key
J1 = USB_Type_C_6P_RA_TH: USB-C (USB TYPE-C) Receptacle Connector 24 (6+18 Dummy) Position Surface Mount, Right Angle; Through Hole; Manufacturer: GCT; Package: Cut-Tape; Manufacturer Part Number: USB4125-GF-A_REVA2; Price: None; Availability: Available; ComponentLink1Description: Digikey Link; ComponentLink1URL: https://www.digikey.com/en/products/detail/gct/USB4125-GF-A/13547388; Category: Connectors; Supplier: Digikey; Supplier Part Number 1: 2073-USB4125-GF-ACT-ND
LED2 = 150060GS75000: LED, 0603, GREEN, 430MCD, 520NM; Manufacturer: Wurth Electronics; Dynamic Catalog: 0603 Rectangle with Flat Top Chip LEDs; 3D Model: SMCW_0603.igs / SMCW_0603.stp / SMCW_0603.wrl; Wavelength - Peak: 515nm; Voltage - Forward (Vf) (Typ): 3.2V; Current - Test: 20mA; Viewing Angle: 140°; Lens Type: Clear; Lens Style/Size: Rectangle with Flat Top, 1.1mm x 0.7mm; Other Names: 732-4971-2; Supplier 1: Digi-Key; Manufacturer Part Number: 150060GS75000; Stock 1: 34964; Pricing 1: 1=0.14, 50=0.129, 100=0.11, 500=0.095 (USD); Standard Package: 4,000; Category: Optoelectronics; Family: LED Indication - Discrete; Series: WL-SMCW; Packaging: Tape & Reel (TR); Color: Green; Wavelength - Dominant: 520nm; Millicandela Rating: 430mcd; Package / Case: 0603 (1608 Metric); Size / Dimension: 1.60mm L x 0.80mm W; Height: 0.70mm; Mounting Type: Surface Mount; Online Catalog: 0603 Rectangle with Flat Top Chip LEDs; ComponentLink1URL: https://katalog.we-online.de/led/datasheet/150060GS75000.pdf?src-supplier=Digi-Key; ComponentLink1Description: https://katalog.we-online.de/led/datasheet/150060GS75000.pdf?src-supplier=Digi-Key; ComponentLink2URL: http://www.produktinfo.conrad.com/datenblaetter/750000-774999/759427-da-01-en-CHIPLED_0603_W_KL_GRUEN_150060GS75000.pdf?src-supplier=Conrad; ComponentLink2Description: http://www.produktinfo.conrad.com/datenblaetter/750000-774999/759427-da-01-en-CHIPLED_0603_W_KL_GRUEN_150060GS75000.pdf?src-supplier=Conrad; Supplier Part Number 1: 732-4971-1-ND
R12 R14 = RC0603FR-075K1L: RES SMD 5.1K OHM 1% 1/10W 0603; Manufacturer: Yageo; Additional Feature: LASER TRIMMABLE; Power: 100mW; Rated Temperature: 70°C; Value: 5.1kR; Temperature Coefficient: 100ppm/°C; Working Voltage: 75V; Package Height: 0.45mm; Package Length: 1.6mm; Package Width: 0.8mm; Supplier: Digi-Key; Supplier Part Number: 311-5.10KHRCT-ND; Manufacturer Part Number: RC0603FR-075K1L; RoHS: Yes; Category: Chip SMD Resistors; Stock: 2955457; Pricing: 1=0.1, 10=0.018, 50=0.0106, 100=0.0088, 500=0.00592, 1000=0.00505 (USD); Mounting Technology: Surface Mount; Pins: 2; Package Shape: Rectangular; Case/Package: 0603; Terminal Finish: Nickel; Min Operating Temperature: -55°C; Max Operating Temperature: 155°C; Tolerance: 1%; JESD-609 Code: e3; Resistor Type: FIXED RESISTOR; Construction: Chip; Package Style: SMTMeter; Packaging: Tape and Reel; Technology: METAL GLAZE/THICK FILM; Termination: Wraparound; Reach SVHC Compliant: Yes; RoHS Compliant: Yes; ComponentLink1URL: https://datasheet.ciiva.com:443/pdfs/VipMasterIC/IC/YAGO/YAGO-S-A0008145938/YAGO-S-A0008145938-1.pdf?src-supplier=IHS+Markit; ComponentLink1Description: https://datasheet.ciiva.com:443/pdfs/VipMasterIC/IC/YAGO/YAGO-S-A0008145938/YAGO-S-A0008145938-1.pdf?src-supplier=IHS+Markit; ComponentLink2URL: https://datasheet.ciiva.com/46395/443971-46395016.pdf?src-supplier=Element14; ComponentLink2Description: https://datasheet.ciiva.com/46395/443971-46395016.pdf?src-supplier=Element14; ComponentLink3URL: https://datasheet.ciiva.com/2454/pyu-r-int-thick-7-2454046.pdf?src-supplier=Digi-Key; ComponentLink3Description: https://datasheet.ciiva.com/2454/pyu-r-int-thick-7-2454046.pdf?src-supplier=Digi-Key; ComponentLink4URL: https://datasheet.ciiva.com/2454/pyu-r-int-thick-7-2454047.pdf?src-supplier=Digi-Key; ComponentLink4Description: https://datasheet.ciiva.com/2454/pyu-r-int-thick-7-2454047.pdf?src-supplier=Digi-Key; ComponentLink5URL: https://datasheet.ciiva.com/2454/pyu-r-int-thick-7-2454045.pdf?src-supplier=Digi-Key; ComponentLink5Description: https://datasheet.ciiva.com/2454/pyu-r-int-thick-7-2454045.pdf?src-supplier=Digi-Key; ComponentLink6URL: https://datasheet.ciiva.com/15189/getdatasheetpartid-326732-15189786.pdf?src-supplier=Verical; ComponentLink6Description: https://datasheet.ciiva.com/15189/getdatasheetpartid-326732-15189786.pdf?src-supplier=Verical
R13 = RMCF0603ZT0R00: RES SMD 0 OHM 1/10W 0603; Manufacturer: Stackpole Electronics; Value: 0R; Max Power Dissipation: 100mW; Voltage Rating: 75V; Supplier: Digi-Key; Supplier Part Number: RMCF0603ZT0R00CT-ND; Manufacturer Part Number: RMCF0603ZT0R00; RoHS: Yes; Category: Chip SMD Resistors; Stock: 12799112; Pricing: 1=0.1, 10=0.013, 25=0.0096, 50=0.0072, 100=0.0054, 250=0.00408, 500=0.00328, 1000=0.00241 (USD); Mounting Technology: Surface Mount; Case/Package: 0603; Case Code (Metric): 1608; Case Code (Imperial): 0603; Contact Plating: Tin,Matte; Min Operating Temperature: -55°C; Max Operating Temperature: 155°C; Packaging: Tape and Reel; Series: RMCF; Number of Terminations: 2; Features: Automotive AEC-Q200; Construction: Rectangular; Length: 1.55mm; Width: 0.031inch; Height: 0.022inch; Depth: 0.8mm; Radiation Hardening: No; Military Standard: Not; RoHS Compliant: Yes; ComponentLink1URL: https://datasheet.octopart.com/RMCF0603ZT0R00-Stackpole-Electronics-datasheet-11547379.pdf?src-supplier=Future+Electronics; ComponentLink1Description: https://datasheet.octopart.com/RMCF0603ZT0R00-Stackpole-Electronics-datasheet-11547379.pdf?src-supplier=Future+Electronics; ComponentLink2URL: https://www.seielect.com/catalog/SEI-Packaging.pdf?src-supplier=Avnet; ComponentLink2Description: https://www.seielect.com/catalog/SEI-Packaging.pdf?src-supplier=Avnet; ComponentLink3URL: https://www.seielect.com/catalog/SEI-Packaging.pdf?src-supplier=Arrow+Electronics; ComponentLink3Description: https://www.seielect.com/catalog/SEI-Packaging.pdf?src-supplier=Arrow+Electronics; ComponentLink4URL: https://www.seielect.com/catalog/SEI-Packaging.pdf?src-supplier=Verical; ComponentLink4Description: https://www.seielect.com/catalog/SEI-Packaging.pdf?src-supplier=Verical; ComponentLink5URL: https://www.seielect.com/Catalog/SEI-RMCF_RMCP.pdf?src-supplier=Digi-Key; ComponentLink5Description: https://www.seielect.com/Catalog/SEI-RMCF_RMCP.pdf?src-supplier=Digi-Key; ComponentLink6URL: https://www.seielect.com/catalog/SEI-Packaging.pdf?src-supplier=Digi-Key; ComponentLink6Description: https://www.seielect.com/catalog/SEI-Packaging.pdf?src-supplier=Digi-Key; ComponentLink7URL: https://datasheet.octopart.com/RMCF0603ZT0R00-Stackpole-Electronics-datasheet-154799224.pdf?src-supplier=Master+Electronics; ComponentLink7Description: https://datasheet.octopart.com/RMCF0603ZT0R00-Stackpole-Electronics-datasheet-154799224.pdf?src-supplier=Master+Electronics
R15 = RC0603FR-071KL: as R16 on sheet PTFV_GECKO_SNSR; Supplier: Digi-Key; Supplier Part Number: 311-1.00KHRCT-ND; Manufacturer Part Number: RC0603FR-071KL; RoHS: Yes; Category: Chip SMD Resistors; Stock: 18911788; Pricing: 1=0.1, 10=0.018, 50=0.0106, 100=0.0088, 500=0.00592, 1000=0.00505 (USD); Case/Package: 0603; Case Code (Imperial): 0603; Case Code (Metric): 1608; Contact Plating: Tin,Matte; Min Operating Temperature: -55°C; Max Operating Temperature: 155°C; Tolerance: 1%; Packaging: Tape and Reel; Termination: SMD/SMT; Resistor Type: Thick Film; Features: Moisture Resistant; Series: RC; Max Power Dissipation: 100mW; Number of Terminations: 2; Resistance Tolerance: 1%; Construction: Rectangular; Technology: THICK FILM; Length: 1.6mm; Height: 0.45mm; Depth: 0.8mm; Reach SVHC Compliant: No; Military Standard: Not; RoHS Compliant: Yes; Lead Free: 5697LeadFree

## Nets that join several sheets
1V8: PTFV_PWR_PMIC (C5.1 LED1.A R1.2 U2.2), PTFV_GECKO_SNSR (C21.1 C22.1 U4.11)
3V3: PTFV_PWR_PMIC (U2.3), PTFV_GECKO_PWR (12 pins), PTFV_GECKO_SNSR (17 pins), PTFV_MECHANICAL (H3.2 LED2.A)
GND: PTFV_PWR_PMIC (20 pins), PTFV_GECKO_PWR (22 pins), PTFV_GECKO_SNSR (28 pins), PTFV_MECHANICAL (11 pins)
NetC3_1: PTFV_PWR_PMIC (C3.1 L1.1 U1.2), PTFV_MECHANICAL (H2.2)
NetC6_1: PTFV_PWR_PMIC (C6.1 L2.2 U1.14), PTFV_MECHANICAL (H3.3)
NetC8_1: PTFV_GECKO_PWR (C8.1 R11.2 U3.12), PTFV_MECHANICAL (R13.1)
NetH1_4: PTFV_GECKO_SNSR (U3.4), PTFV_MECHANICAL (H1.4)
NetH1_5: PTFV_GECKO_SNSR (U3.5), PTFV_MECHANICAL (H1.5)
NetH1_6: PTFV_GECKO_SNSR (U3.3), PTFV_MECHANICAL (H1.6)
NetH1_7: PTFV_GECKO_SNSR (U3.2), PTFV_MECHANICAL (H1.7)
NetH1_8: PTFV_GECKO_SNSR (U3.1), PTFV_MECHANICAL (H1.8)
NetH1_9: PTFV_GECKO_SNSR (U3.7), PTFV_MECHANICAL (H1.9)
NetH1_10: PTFV_GECKO_SNSR (U3.6), PTFV_MECHANICAL (H1.10)
NetH2_3: PTFV_PWR_PMIC (V2.1), PTFV_MECHANICAL (H2.3)
NetU1_13: PTFV_PWR_PMIC (U1.13), PTFV_GECKO_SNSR (U3.24)